# EasyEDA schematic SCH_EsquematicoCorregido_Final.json
TITLE: Sheet_1; REV: 1.0; Date: 01/05/2026; Sheet: 1/1; Drawn By: Cristian Becerra              / Mateo Leon; Company: Universidad de Pamplona
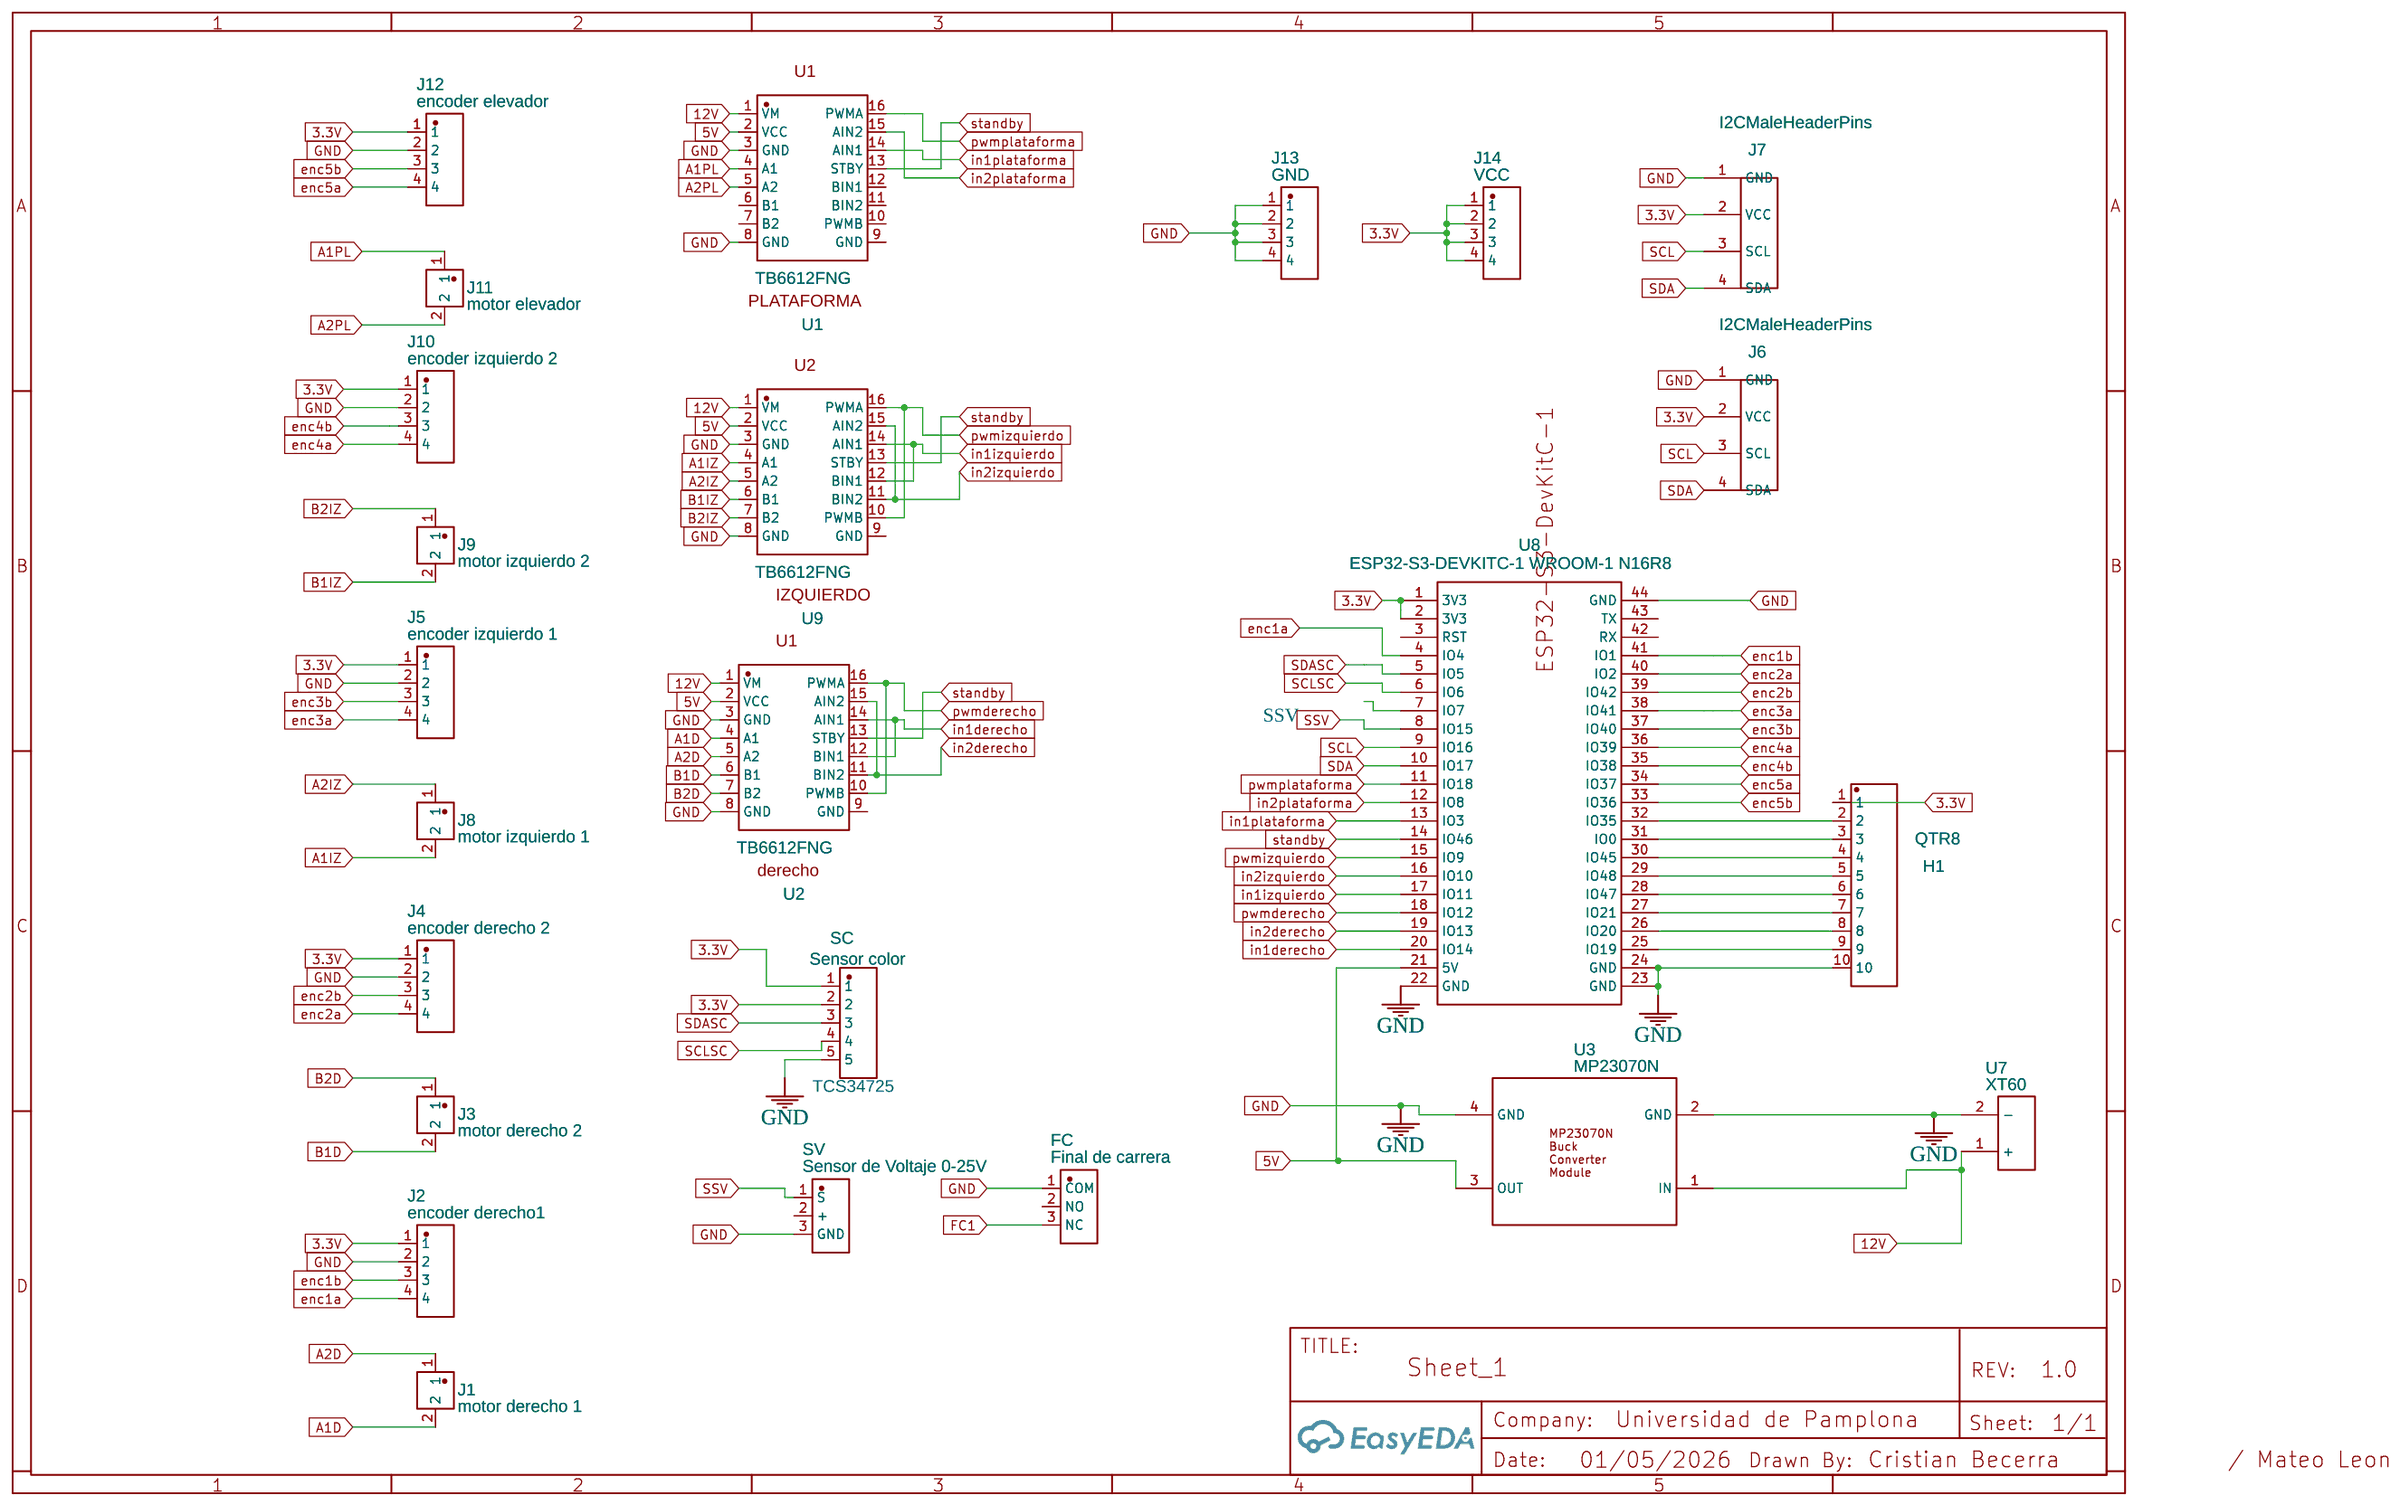
[diagram p0: schematic sheet]

## Parts
FC  Final de carrera  [CONN-TH_5557WRF-1X3P-HDGC4201WR-F-1X3P]
H1  QTR8  [HDR-TH_10P-P2.54-V-M-1]
J1  motor derecho 1  [CONN-TH_2P-P2.50-XH2.54-2P]
J2  encoder derecho1  [CONN-TH_4P-P2.54_MOLEX_38001334]
J3  motor derecho 2  [CONN-TH_2P-P2.50-XH2.54-2P]
J4  encoder derecho 2  [CONN-TH_4P-P2.54_MOLEX_38001334]
J5  encoder izquierdo 1  [CONN-TH_4P-P2.54_MOLEX_38001334]
J6  I2CMaleHeaderPins  [I2CMALEHEADER]
J7  I2CMaleHeaderPins  [I2CMALEHEADER]
J8  motor izquierdo 1  [CONN-TH_2P-P2.50-XH2.54-2P]
J9  motor izquierdo 2  [CONN-TH_2P-P2.50-XH2.54-2P]
J10  encoder izquierdo 2  [CONN-TH_4P-P2.54_MOLEX_38001334]
J11  motor elevador  [CONN-TH_2P-P2.50-XH2.54-2P]
J12  encoder elevador  [CONN-TH_4P-P2.54_MOLEX_38001334]
J13  GND  [CONN-TH_4P-P2.54_MOLEX_38001334]
J14  VCC  [CONN-TH_4P-P2.54_MOLEX_38001334]
SC  Sensor color  [CONN-SMD_5557WR-1X5P-HDGC4201WR-1X5P]
SV  Sensor de Voltaje 0-25V  [CONN-TH_5557WRF-1X3P-HDGC4201WR-F-1X3P]
U1  TB6612FNG  [TB6612FNG]
U2  TB6612FNG  [TB6612FNG]
U3  MP23070N  [MP23070N BUCK CONVERTER MODULE]
U7  XT60  [RAMO_XT60]
U8  ESP32-S3-DEVKITC-1 WROOM-1 N16R8  [ESP32-S3-DEVKITC-1 WROOM-1 N16R8]
U9  TB6612FNG  [TB6612FNG]

## Library data of the parts
FC SV = 5557WRF-1X3P(HDGC4201WR-F-1X3P): Supplier: LCSC; Supplier Part: C54557117; Manufacturer: HDGC(华德共创); Contributor: lcsc; JLCPCB Part Class: Extended Part
H1 = Header-Male-2.54_1x10: Supplier: LCSC; Manufacturer Part: 2.54-1*10P针; Supplier Part: C57369; JLCPCB Part Class: Extended Part; Manufacturer: BOOMELE(博穆精密)
J1 J3 J8 J9 J11 = 2.54*2P-P=2.54MM: Contributor: lcsc; Supplier: LCSC; Supplier Part: C9900005596; Manufacturer: null; Manufacturer Part: 2.54*2P-P=2.54mm; JLCPCB Part Class: Extended Part
J2 J4 J5 J10 J12-J14 = 38001334: Contributor: LCSC; Supplier: LCSC; Supplier Part: C587416; Manufacturer: MOLEX; JLCPCB Part Class: Extended Part
J6 J7 = I2CMaleHeaderPins: catid: 20; Contributor: rcobthegreat; sim: true
SC = 5557WR-1X5P(HDGC4201WR-1X5P): Supplier: LCSC; Supplier Part: C54557116; Manufacturer: HDGC(华德共创); Contributor: lcsc; JLCPCB Part Class: Extended Part
U1 U2 U9 = TB6612FNG SPARKFUN: Contributor: NonpawitE
U3 = MP23070N BUCK CONVERTER MODULE: Manufacturer Part: MP23070N Buck Converter Module; Contributor: caginpolat
U7 = XT60: Contributor: ramoheli; sim: true
U8 = ESP32-S3-DEVKITC-1 WROOM-1 N16R8: Manufacturer: Espressif; Supplier: Espressif; Contributor: aliawrang

## Nets
3.3V: H1.1 J2.1 J4.1 J5.1 J6.2(VCC) J7.2(VCC) J10.1 J12.1 J14.1 J14.2 J14.3 J14.4 SC.1 SC.2 U8.1(3V3) U8.2(3V3)
5V: U1.2(VCC) U2.2(VCC) U3.3(OUT) U8.21(5V) U9.2(VCC)
12V: U1.1(VM) U2.1(VM) U3.1(IN) U7.1(+) U9.1(VM)
GND: FC.1(COM) H1.10 J2.2 J4.2 J5.2 J6.1(GND) J7.1(GND) J10.2 J12.2 J13.1 J13.2 J13.3 J13.4 SC.5 SV.3(GND) U1.3(GND) U1.8(GND) U2.3(GND) U2.8(GND) U3.2(GND) U3.4(GND) U7.2(-) U8.22(GND) U8.23(GND) U8.24(GND) U8.44(GND) U9.3(GND) U9.8(GND)
A1D: J1.2 U2.4(A1)
A1IZ: J8.2 U9.4(A1)
A1PL: J11.1 U1.4(A1)
A2D: J1.1 U2.5(A2)
A2IZ: J8.1 U9.5(A2)
A2PL: J11.2 U1.5(A2)
B1D: J3.2 U2.6(B1)
B1IZ: J9.2 U9.6(B1)
B2D: J3.1 U2.7(B2)
B2IZ: J9.1 U9.7(B2)
enc1a: J2.4 U8.4(IO4)
enc1b: J2.3 U8.41(IO1)
enc2a: J4.4 U8.40(IO2)
enc2b: J4.3 U8.39(IO42)
enc3a: J5.4 U8.38(IO41)
enc3b: J5.3 U8.37(IO40)
enc4a: J10.4 U8.36(IO39)
enc4b: J10.3 U8.35(IO38)
enc5a: J12.4 U8.34(IO37)
enc5b: J12.3 U8.33(IO36)
FC1: FC.3(NC)
in1derecho: U2.12(BIN1) U2.14(AIN1) U8.20(IO14)
in1izquierdo: U8.17(IO11) U9.12(BIN1) U9.14(AIN1)
in1plataforma: U1.14(AIN1) U8.13(IO3)
in2derecho: U2.11(BIN2) U2.15(AIN2) U8.19(IO13)
in2izquierdo: U8.16(IO10) U9.11(BIN2) U9.15(AIN2)
in2plataforma: U1.15(AIN2) U8.12(IO8)
pwmderecho: U2.10(PWMB) U2.16(PWMA) U8.18(IO12)
pwmizquierdo: U8.15(IO9) U9.10(PWMB) U9.16(PWMA)
pwmplataforma: U1.16(PWMA) U8.11(IO18)
SCL: J6.3(SCL) J7.3(SCL) U8.9(IO16)
SCLSC: SC.4 U8.6(IO6)
SDA: J6.4(SDA) J7.4(SDA) U8.10(IO17)
SDASC: SC.3 U8.5(IO5)
SSV: SV.1(S) U8.8(IO15)
standby: U1.13(STBY) U2.13(STBY) U8.14(IO46) U9.13(STBY)
Net-(H1-2): H1.2 U8.32(IO35)
Net-(H1-3): H1.3 U8.31(IO0)
Net-(H1-4): H1.4 U8.30(IO45)
Net-(H1-5): H1.5 U8.29(IO48)
Net-(H1-6): H1.6 U8.28(IO47)
Net-(H1-7): H1.7 U8.27(IO21)
Net-(H1-8): H1.8 U8.26(IO20)
Net-(H1-9): H1.9 U8.25(IO19)

Not connected (* = marked no-connect by the designer): FC 2(NO); SV 2(+); U1 6(B1) 7(B2) 9(GND) 10(PWMB) 11(BIN2) 12(BIN1); U2 9(GND); U8 3(RST) 7(IO7) 42(RX) 43(TX); U9 9(GND)

## Notes on the sheet
- SSV
- TCS34725
